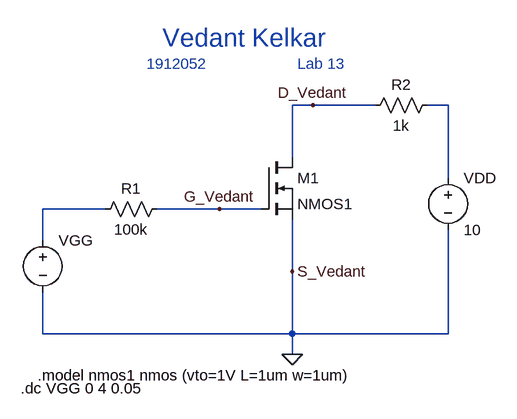
[diagram p0: schematic Draft26.asc]
Draft26.asc, the LTspice schematic file:
Version 4
SHEET 1 880 680
WIRE 304 192 272 192
WIRE 400 192 304 192
WIRE 512 192 480 192
WIRE 272 272 272 192
WIRE 512 304 512 192
WIRE -16 352 -112 352
WIRE 160 352 64 352
WIRE 224 352 160 352
WIRE -112 400 -112 352
WIRE 272 448 272 368
WIRE -112 544 -112 480
WIRE 272 544 272 448
WIRE 272 544 -112 544
WIRE 512 544 512 384
WIRE 512 544 272 544
WIRE 272 576 272 544
FLAG 272 576 0
FLAG 304 192 D_Vedant
FLAG 160 352 G_Vedant
FLAG 272 448 S_Vedant
SYMBOL nmos 224 272 R0
SYMATTR InstName M1
SYMATTR Value NMOS1
SYMBOL res 80 336 R90
WINDOW 0 0 56 VBottom 2
WINDOW 3 32 56 VTop 2
SYMATTR InstName R1
SYMATTR Value 100k
SYMBOL res 496 176 R90
WINDOW 0 0 56 VBottom 2
WINDOW 3 32 56 VTop 2
SYMATTR InstName R2
SYMATTR Value 1k
SYMBOL voltage -112 384 R0
WINDOW 123 0 0 Left 0
WINDOW 39 0 0 Left 0
SYMATTR InstName VGG
SYMATTR Value ""
SYMBOL voltage 512 288 R0
WINDOW 123 0 0 Left 0
WINDOW 39 0 0 Left 0
SYMATTR InstName VDD
SYMATTR Value 10
TEXT 72 88 Left 4 ;Vedant Kelkar
TEXT 48 128 Left 2 ;1912052
TEXT 280 128 Left 2 ;Lab 13
TEXT -120 608 Left 2 !.model nmos1 nmos (vto=1V L=1um w=1um)
TEXT -146 628 Left 2 !.dc VGG 0 4 0.05

The netlist it stands for:
* Draft26.asc
M1 D_Vedant G_Vedant 0 0 NMOS1
R1 G_Vedant N002 100k
R2 N001 D_Vedant 1k
VGG N002 0
VDD N001 0 10
.model NMOS NMOS
.model PMOS PMOS
.lib standard.mos
* Vedant Kelkar
* 1912052
* Lab 13
.model nmos1 nmos (vto=1V L=1um w=1um)
.dc VGG 0 4 0.05
.backanno
.end